# EAGLE board 612_jetracer_328_020022 (EAGLE 9.6.2)
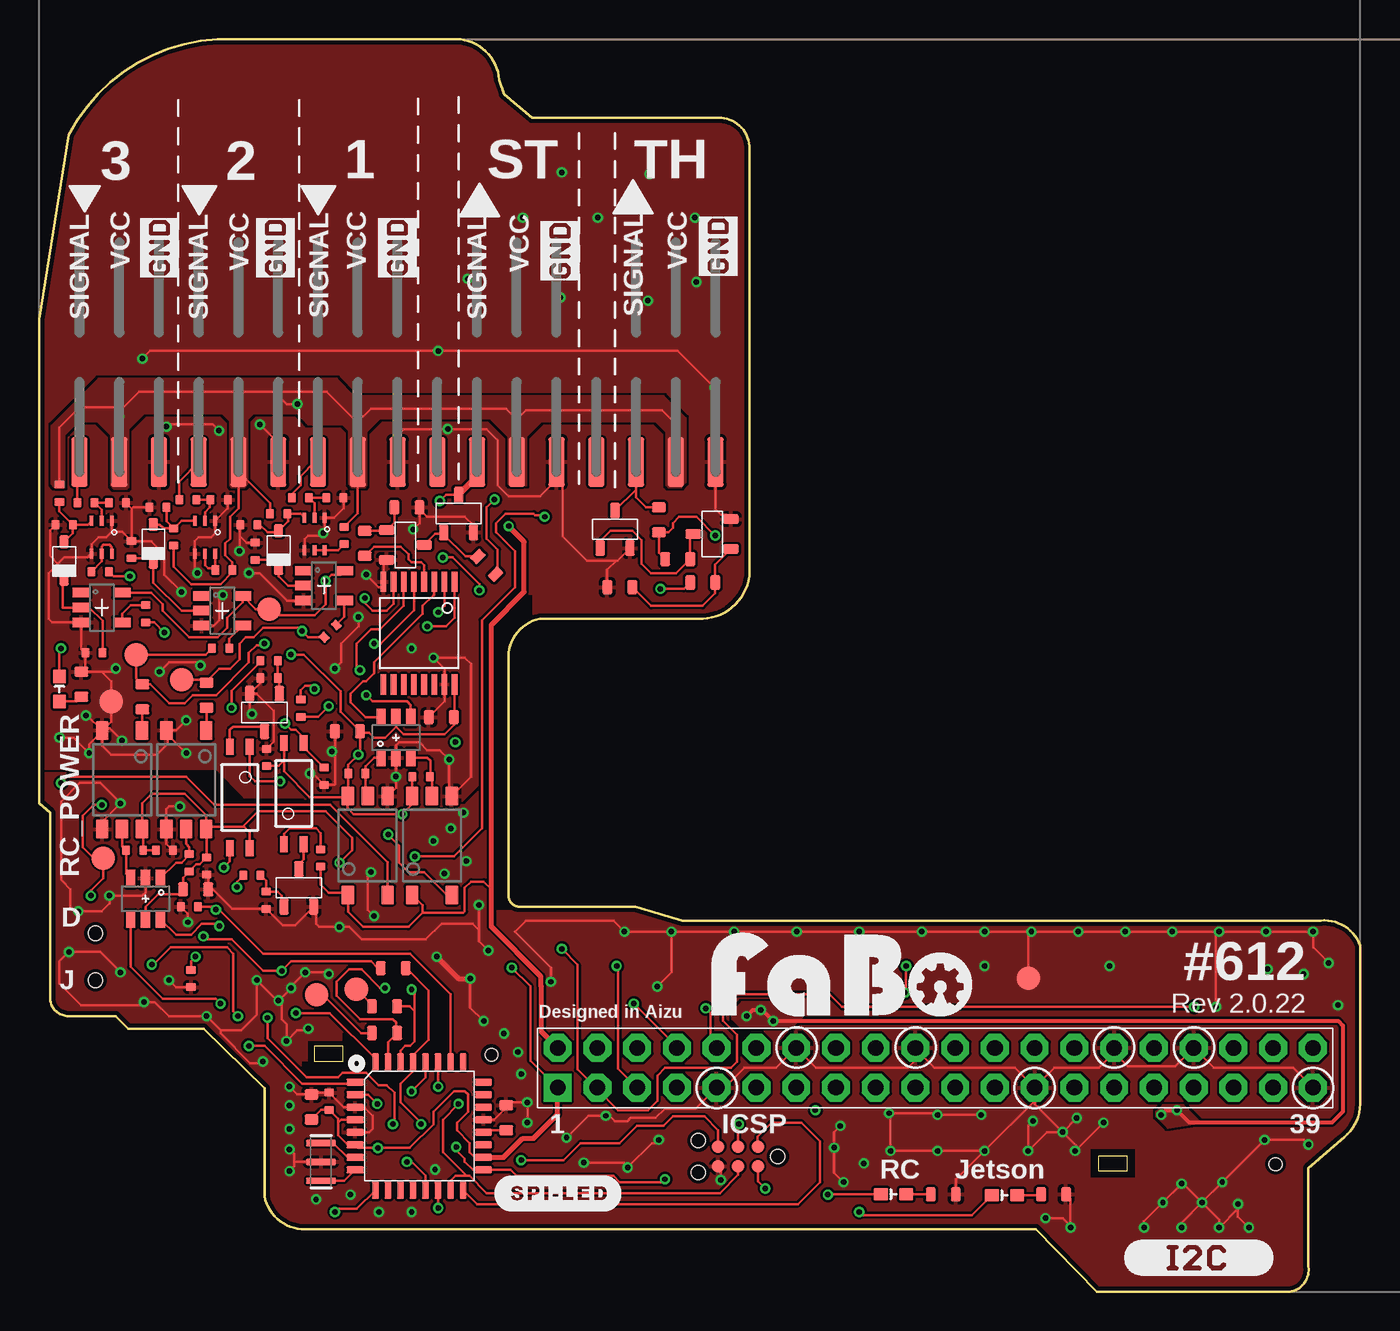
[diagram p9: board, top side]
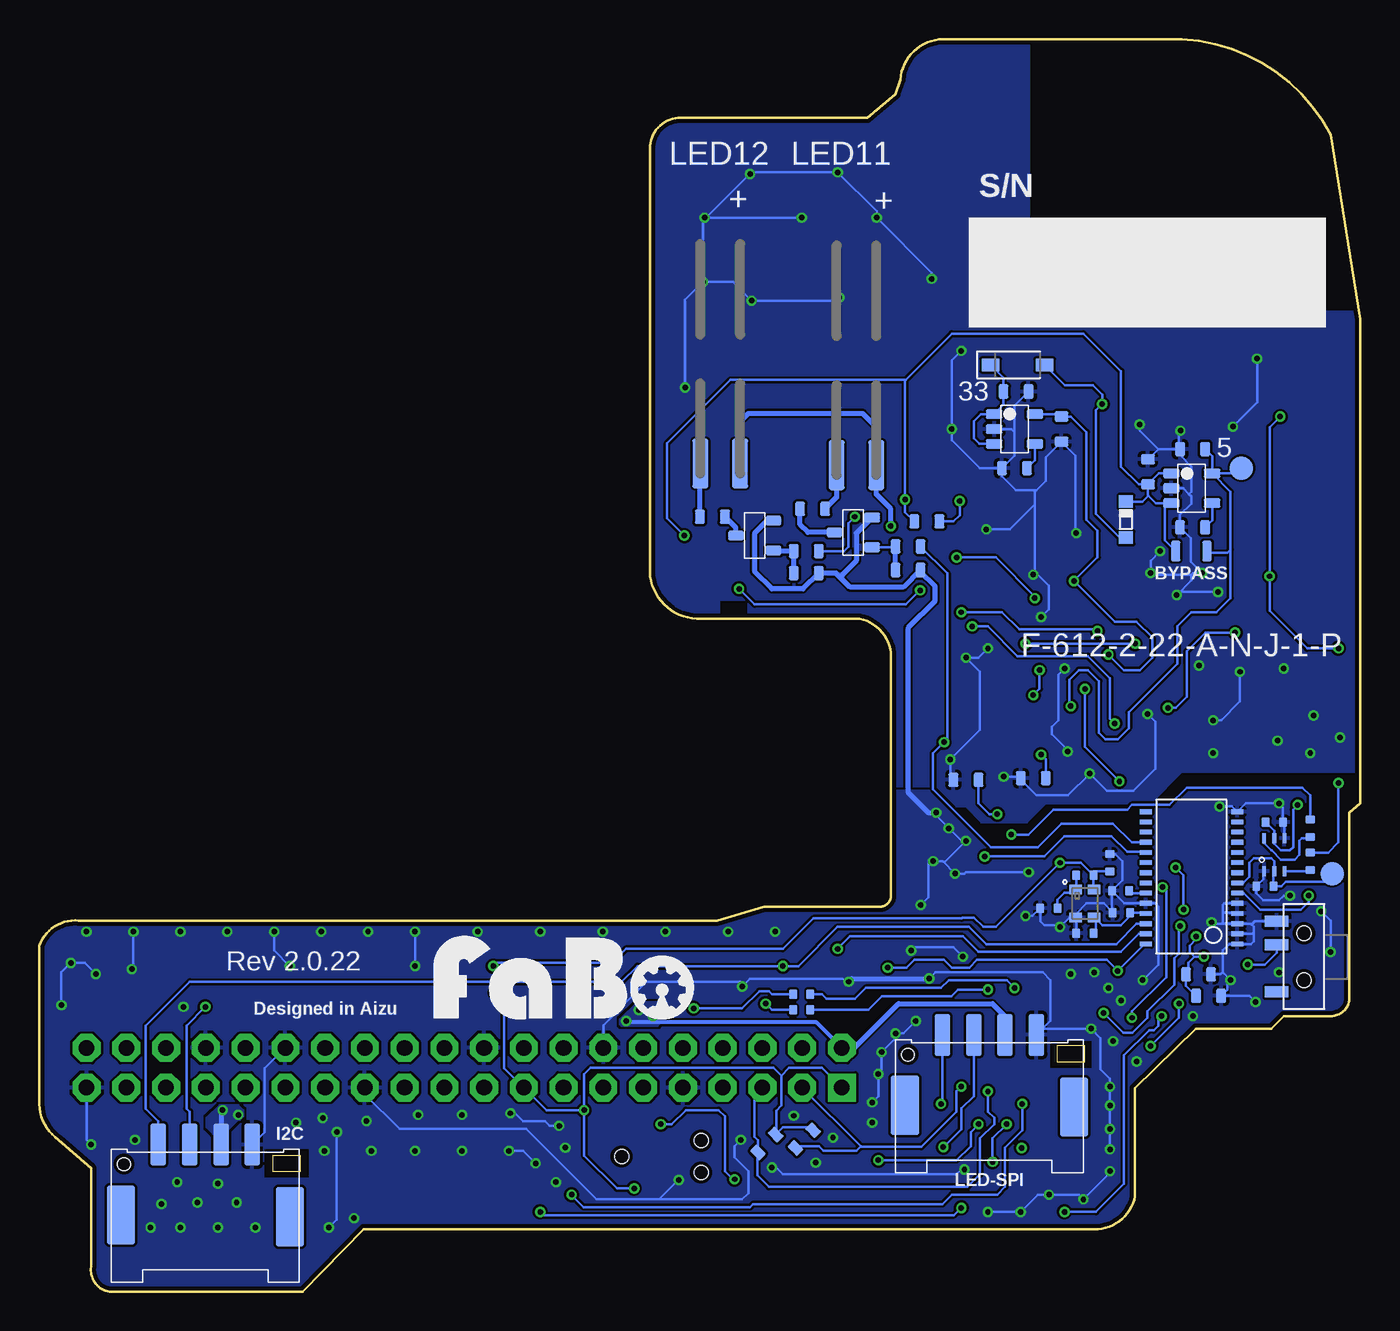
[diagram p10: board, bottom side, seen from below]

Size 84.42 x 80.01 mm. Coordinates in mm from the lower left corner, seen from the top.
Outline: 0,31.2 0,62.1 1.9,73.9 arc-60 11.4,80 26.4,80 arc-90 29.4,77.4 29.7,76.5 31.5,75 43.4,75 arc-90 45.4,73 45.4,46 arc-86 42.4,43 32,43 arc71 30,40.8 30,25.3 arc85 30.6,24.6 38.1,24.6 41.1,23.7 81.9,23.7 arc-78 84.4,22.1 84.4,12.5 arc-61 83.2,9.7 81.1,7.9 81.1,1.6 arc-90 79.9,0 67.6,0 63.7,4 17,4 arc-80 14.4,6.1 14.4,13 10.5,16.8 5.7,16.8 4.9,17.6 1.9,17.6 arc-85 0.7,18.7 0.7,30.6 0,31.2
Copper layers (1*16): Top 0.035mm / dielectric 1.6mm / Bottom 0.035mm
Design rules "PCBway": minimum track width 6mil, minimum drill 12mil, track to track 6mil, track to pad 6mil, pad to pad 6mil, via to via 6mil, smd to smd 6mil, copper to edge 10mil, drill to drill 10mil, minimum pad ring 10mil, minimum via ring 6mil, stop-mask expansion 2mil, vias tented up to drill 100mil, thermal gap 8mil
bKeepout: area 2.5,70.2 to 27,91.4
tRestrict: area 17.2,14.3 to 19.8,16; area 67.2,7.3 to 70,9.1; area 29.1,24.4 to 30.6,31.5; area 29.1,31.6 to 30.7,41.6; area 30.8,43 to 31.5,44.1; area 31.1,44.1 to 31.5,44.5; area 28.4,29.5 to 28.6,31.6; area 16.8,14.2 to 17.2,14.7; area 19.4,16 to 19.7,16.5
bRestrict: area -2.9,62.7 to 21.1,82.8; area 67.2,7.3 to 70,9.1; area 17.2,14.3 to 19.8,16; area 39.2,42.6 to 40.9,44.1

## Footprints (pad centres in the part's own frame; a part is rotated, then mirrored left to right if it is on the bottom)
0805 = smd 0.6 x 1.3: 1 -1,0; 2 1,0
0603 = smd 0.65 x 0.9: 1 -0.8,0; 2 0.8,0
0402 = smd 0.5 x 0.6: 1 -0.55,0; 2 0.55,0
SOD3715X135 = smd 1.127 x 0.784: 1 -1.722,0; 2 1.722,0
CUS05F40 = smd 0.8 x 0.9: A -1.15,0; C 1.15,0
SOD-323 = smd 0.8 x 0.6: A -1.2,0; K 1.2,0
PNHEADER_2.54_SMT_LEDLIGHT = smd 1.02 x 3.17: 1:GND -1.27,0; 2:POWER 1.27,0
I2C-BM04B-PASS-1 = smd 1 x 2.7: 5V -1,0; GND -3,0; SCL 3,0; SDA 1,0 | smd 1.8 x 3.8: P$5 -5.4,4.6; P$6 5.4,4.5 | hole 0.8: 5.2,1.25
TQFP-32 = smd 1.1 x 0.45: 1 -4.1,2.8; 2 -4.1,2; 3 -4.1,1.2; 4 -4.1,0.4; 5 -4.1,-0.4; 6 -4.1,-1.2; 7 -4.1,-2; 8 -4.1,-2.8; 17 4.1,-2.8; 18 4.1,-2; 19 4.1,-1.2; 20 4.1,-0.4; 21 4.1,0.4; 22 4.1,1.2; 23 4.1,2; 24 4.1,2.8 | smd 0.45 x 1.1: 9 -2.8,-4.1; 10 -2,-4.1; 11 -1.2,-4.1; 12 -0.4,-4.1; 13 0.4,-4.1; 14 1.2,-4.1; 15 2,-4.1; 16 2.8,-4.1; 25 2.8,4.1; 26 2,4.1; 27 1.2,4.1; 28 0.4,4.1; 29 -0.4,4.1; 30 -1.2,4.1; 31 -2,4.1; 32 -2.8,4.1
JETSON_NANO_NOBOARDER = drill 1 pad 1.778 square: 1 1.27,1.27 | drill 1 pad 1.778 octagon: 2 1.27,3.81; 3 3.81,1.27; 4 3.81,3.81; 5 6.35,1.27; 6 6.35,3.81; 7 8.89,1.27; 8 8.89,3.81; 9 11.43,1.27; 10 11.43,3.81; 11 13.97,1.27; 12 13.97,3.81; 13 16.51,1.27; 14 16.51,3.81; 15 19.05,1.27; 16 19.05,3.81; 17 21.59,1.27; 18 21.59,3.81; 19 24.13,1.27; 20 24.13,3.81; 21 26.67,1.27; 22 26.67,3.81; 23 29.21,1.27; 24 29.21,3.81; 25 31.75,1.27; 26 31.75,3.81; 27 34.29,1.27; 28 34.29,3.81; 29 36.83,1.27; 30 36.83,3.81; 31 39.37,1.27; 32 39.37,3.81; 33 41.91,1.27; 34 41.91,3.81; 35 44.45,1.27; 36 44.45,3.81; 37 46.99,1.27; 38 46.99,3.81; 39 49.53,1.27; 40 49.53,3.81
TSSOP-16 = smd 0.36 x 1.3: 1 -2.275,-3.28; 2 -1.625,-3.28; 3 -0.975,-3.28; 4 -0.325,-3.28; 5 0.325,-3.28; 6 0.975,-3.28; 7 1.625,-3.28; 8 2.275,-3.28; 9 2.275,3.28; 10 1.625,3.28; 11 0.975,3.28; 12 0.325,3.28; 13 -0.325,3.28; 14 -0.975,3.28; 15 -1.625,3.28; 16 -2.275,3.28
PCA9685_BOTTOM = smd 0.3 x 0.75 bottom: 1 4.3,-2.93; 2 3.65,-2.93; 3 3,-2.93; 4 2.35,-2.93; 5 1.7,-2.93; 6 1.05,-2.93; 7 0.4,-2.93; 8 -0.25,-2.93; 9 -0.9,-2.93; 10 -1.55,-2.93; 11 -2.2,-2.93; 12 -2.85,-2.93; 13 -3.5,-2.93; 14 -4.15,-2.93; 15 -4.15,2.92; 16 -3.5,2.92; 17 -2.85,2.92; 18 -2.2,2.92; 19 -1.55,2.92; 20 -0.9,2.92; 21 -0.25,2.92; 22 0.4,2.92; 23 1.05,2.92; 24 1.7,2.92; 25 2.35,2.92; 26 3,2.92; 27 3.65,2.92; 28 4.3,2.92
SOT-23-5 = smd 0.6 x 1.05: 1 -0.95,-1.3; 2 0,-1.3; 3 0.95,-1.3; 4 0.95,1.3; 5 -0.95,1.3
TC2030 = smd 0.787 x 0.787: 1 1.27,-0.635; 2 1.27,0.635; 3 2.54,-0.635; 4 2.54,0.635; 5 3.81,-0.635; 6 3.81,0.635 | hole 0.889: 0,0; 5.08,-1.016; 5.08,1.016
0603' = smd 0.9 x 0.8: ANODE -0.8,0; CATHODE 0.8,0
SPI-BM04B-PASS-1 = smd 1 x 2.7: 5V -1,-0.1; CI 1,-0.1; DI 3,-0.1; GND -3,-0.1 | smd 1.8 x 3.8: P$5 -5.4,4.5; P$6 5.4,4.4 | hole 0.8: 5.2,1.15
SOT-23 = smd 0.6 x 1: 1 -0.95,-1.2; 2 0.95,-1.2; 3 0,1.2
SSSS810701 = smd 0.7 x 1.5: 1 -2.25,1.75; 2 0.75,1.75; 3 2.25,1.75 | hole 0.9: -1.5,0; 1.5,0
SOT-23-6 = smd 0.6 x 1.1: 1 -0.95,-1.3; 2 0,-1.3; 3 0.95,-1.3; 4 0.95,1.3; 5 0,1.3; 6 -0.95,1.3
TP-15 = smd 1.5 x 1.5: 1 0,0
11-3C1 = smd 1 x 0.5: 1 -3.24,0.635; 2 -3.24,-0.635; 3 3.24,-0.635; 4 3.24,0.635
US6 = smd 0.3 x 0.635: 1 -0.65,-1.05; 2 0,-1.05; 3 0.65,-1.05; 4 0.65,1.05; 5 0,1.05; 6 -0.65,1.05
SOT-23' = smd 1.1 x 0.6: 1 -1.3,0.95; 2 -1.3,0; 3 -1.3,-0.95; 4 1.3,-0.95; 5 1.3,0.95
PNHEADER_2.54_SMT_17PIN_RC_TT01_02 = smd 1.02 x 3.17: 1:SIGNAL3 -20.32,0; 2:VCC3 -17.78,0; 3:GND3 -15.24,0; 4:SIGNAL2 -12.7,0; 5:VCC2 -10.16,0; 6:GND2 -7.62,0; 7:SIGNAL1 -5.08,0; 8:VCC1 -2.54,0; 9:GND1 0,0; 10:NC1 2.54,0; 11:ST_SIGNAL 5.08,0; 12:ST_VCC 7.62,0; 13:ST_GND 10.16,0; 14:NC2 12.7,0; 15:TH_SINGNAL 15.24,0; 16:TH_VCC 17.78,0; 17:TH_GND 20.32,0
TLP2362 = smd 0.8 x 1.2: 1 -1.27,-3.15; 3 1.27,-3.15; 4 1.27,3.15; 5 0,3.15; 6 -1.27,3.15
KC2016Z = smd 0.6 x 0.8: #1 -0.9,-0.6; #2 0.9,-0.6; #3 0.9,0.6; #4 -0.9,0.6
CSTNE_V_C = smd 0.4 x 1.9: 1 1.2,0; 2 0,0; 3 -1.2,0

## Placement (x,y rotation side)
BYPASS  DNP/0806  [0805]  10.8,47.3 180 bottom
C1  0.1uF  [0603]  29.84,11.12 270 top
C2  0.1uF  [0603]  10.35,20.27 180 bottom
C3  0.1uF  [0402]  18.52,12.17 270 top
C4  0.1uF/0402  [0402]  10.7,27.2 90 top
C5  0.1uF/0402  [0402]  9.7,20 90 top
C6  10uF  [0603]  9.7,18.9 180 bottom
C7  10uF/0402  [0402]  16,27.4 90 bottom
C8  20pF/0402  [0402]  17.6,22.9 180 bottom
C9  0.1uF  [0603]  20.9,32.8 0 bottom
C10  0.1uF  [0603]  25.7,36.7 0 top
C11  4.7uF  [0603]  19.1,55.1 90 bottom
C12  0.1uF  [0603]  10,25.7 0 top
C13  0.01uF  [0603]  22.1,52.6 0 bottom
C14  0.01uF  [0603]  10.72,48.82 0 bottom
C15  4.7uF  [0603]  10.72,53.83 0 bottom
C16  1uF  [0603]  22,57.5 180 bottom
C18  0.1uF/0402  [0402]  8,28.2 180 top
C19  0.1uF/0402  [0402]  14.53,34.12 270 top
C20  0.1uF  [0603]  25.2,32.7 0 bottom
C21  1uF  [0603]  13.57,52.37 270 bottom
C22  0.1uF  [0603]  19.7,35.8 0 top
C23  10uF  [0603]  17.4,11.8 90 top
D1  1N4148W  [SOD3715X135]  21.9,59.2 0 bottom
D2  CUS05F40  [CUS05F40]  14.97,49.32 90 bottom
D4  [SOD-323]  15.3,47.4 270 top
D6  [SOD-323]  7.3,47.8 270 top
D7  [SOD-323]  1.6,46.7 270 top
FRONT_LED  RC_LIGHT  [PNHEADER_2.54_SMT_LEDLIGHT]  40.9,52.9 0 bottom
I2C  FABO-I2C_BM04B  [I2C-BM04B-PASS-1]  73.8,9.4 180 bottom
IC1  [TQFP-32]  24.29,10.59 0 top
IC2  JETSON_NANO_NOBORDER  [JETSON_NANO_NOBOARDER]  31.86,11.77 0 top
IC3  MULTIPLEXERSMC74HC157A  [TSSOP-16]  24.27,42.07 180 top
IC4  PCA9685_BOTTOM  [PCA9685_BOTTOM]  10.79,26.51 270 top
IC5  [SOT-23-5]  10.78,51.32 270 bottom
IC7  [SOT-23-5]  22.1,55.1 270 bottom
ICSP1  [TC2030]  47.2,8.63 180 top
JETSON  GREEN  [0603']  54.59,6.24 0 top
LED-SPI  [SPI-BM04B-PASS-1]  23.7,16.3 180 bottom
M1  MOSFET-N_FDV301N  [SOT-23]  38.7,48.3 90 bottom
M4  MOSFET-N_FDV301N  [SOT-23]  32.4,48.5 90 bottom
R1  0/0402  [0402]  15.28,24.22 0 bottom
R2  10K  [0603]  22.62,20.67 180 top
R3  10K/0402  [0402]  15.32,25.62 0 bottom
R4  330/0402  [0402]  3.2,29.6 270 bottom
R5  470  [0603]  64.82,6.22 180 top
R6  330/0402  [0402]  3.2,27.5 270 bottom
R7  0/0402  [0402]  18.6,42.2 45 top
R8  0/0402  [0402]  11.6,41.1 0 top
R9  0/0402  [0402]  6.8,43.3 90 top
R10  1K  [0603]  57.77,6.22 180 top
R11  1K  [0603]  28.6,46.4 135 top
R12  470  [0603]  22.07,18.23 0 top
R13  470  [0603]  22.07,16.52 0 top
R14  330  [0603]  27.7,49.2 0 bottom
R15  220  [0603]  6.6,38 270 top
R17  DNP/0402  [0402]  6.1,25.9 0 bottom
R18  100  [0603]  20.8,47.8 90 top
R19  1K  [0603]  23.5,50.1 0 top
R20  1K  [0603]  40.8,46.8 0 top
R21  330  [0603]  39.6,49.3 90 top
R22  10K  [0603]  37.92,9.47 45 bottom
R23  10K  [0603]  35.53,9.75 45 bottom
R24  4.7K/0402  [0402]  9.6,24.6 180 top
R25  220/0402  [0402]  16.73,37.27 90 top
R26  DNP/0402  [0402]  5.5,30 180 bottom
R27  220  [0603]  10.7,38.1 270 top
R28  4.7K/0402  [0402]  14.7,40.3 180 top
R29  10K/0402  [0402]  18.23,32.92 90 top
R30  220/0402  [0402]  18,27.7 270 top
R32  10K/0402  [0402]  14.7,39.2 180 top
R33  470  [0603]  2.7,38.8 90 top
R35  1K/0402  [0402]  13.6,26.6 180 top
R36  10K/0402  [0402]  14.5,25 90 top
R37  1K  [0603]  35.4,47.3 0 bottom
R38  10K  [0603]  28.9,47.6 0 bottom
R39  75  [0603]  41.4,49.5 180 bottom
R40  75  [0603]  35,50 0 bottom
R41  DNF  [0603]  35.4,45.9 180 bottom
R42  DNF  [0603]  28.9,46.1 180 bottom
R43  0/0402  [0402]  17.6,26.6 0 bottom
R44  DNP/0402  [0402]  19.9,24.5 0 bottom
R45  DNP/0402  [0402]  35.7,18 180 bottom
R46  DNP/0402  [0402]  35.7,19 180 bottom
R47  100  [0603]  42.4,45.3 0 top
R48  1K  [0603]  37.1,45 180 top
R49  390/0402  [0402]  9.6,27.4 270 top
R50  390/0402  [0402]  6.1,28.2 0 top
R51  390/0402  [0402]  20.3,33.1 180 top
R52  390/0402  [0402]  24.4,32.9 180 top
R55  1K/0402  [0402]  19.5,48.3 90 top
R56  1K/0402  [0402]  15.3,49.7 180 top
R57  1K/0402  [0402]  11.8,46.1 0 top
R58  1K/0402  [0402]  8.6,48.2 270 top
R59  1K/0402  [0402]  3.9,46 0 top
R60  1K/0402  [0402]  1.3,51 90 top
R61  100/0402  [0402]  16.7,50.7 0 top
R62  100/0402  [0402]  9.5,50.6 0 top
R63  100/0402  [0402]  3,50.4 0 top
R64  4.7K/0402  [0402]  13.8,47.3 270 top
R65  4.7K/0402  [0402]  5.9,47.4 270 top
R66  4.7K/0402  [0402]  3.5,40.8 0 top
R67  100K/0402  [0402]  5,50.4 180 top
R68  100K/0402  [0402]  11.5,50.6 180 top
R69  100K/0402  [0402]  18.9,50.7 180 top
R70  4.7K/0402  [0402]  13.4,49 0 top
R71  4.7K/0402  [0402]  7.6,50.1 0 top
R72  4.7K/0402  [0402]  1.6,49 0 top
RC  RED  [0603']  61.68,6.17 0 top
RC_POWER  ORANGE  [0603']  1.3,38.5 270 top
REAR_LED  RC_LIGHT  [PNHEADER_2.54_SMT_LEDLIGHT]  32.2,52.8 0 bottom
S1  [SSSS810701]  3.6,21.4 90 bottom
T1  [SOT-23]  14.4,37 180 top
T2  [SOT-23]  16.6,25.8 0 top
T3  T2N7002AK  [SOT-23]  26.8,49.7 0 top
T4  T2N7002AK  [SOT-23]  36.8,48.7 0 top
T5  SN74LVC2G04  [SOT-23-6]  6.8,25.1 180 top
T6  SN74LVC2G04  [SOT-23-6]  22.8,35.4 0 top
T10  T2N7002AK  [SOT-23]  23.4,47.7 270 top
T11  T2N7002AK  [SOT-23]  43,48.4 90 top
TP1  [TP-15]  20.27,19.32 90 top
TP2  [TP-15]  17.73,18.98 0 top
TP3  [TP-15]  63.21,20.02 0 top
TP4  [TP-15]  14.7,43.6 0 top
TP5  [TP-15]  9.1,39.1 0 top
TP6  [TP-15]  6.2,40.7 0 top
TP7  [TP-15]  4.6,37.7 0 top
TP8  [TP-15]  4.1,27.7 0 top
TP9  [TP-15]  1.8,26.7 0 bottom
TP10  [TP-15]  7.6,52.6 0 bottom
U3  TLP291A  [11-3C1]  12.82,31.57 270 top
U7  TLP291A  [11-3C1]  16.27,31.82 90 top
U12  SSM6N7002KFU  [US6]  10.6,48.2 180 top
U20  SN74LVC1G17  [SOT-23']  11.7,43.5 0 top
U21  SSM6N7002KFU  [US6]  4,48.2 180 top
U23  SN74LVC1G17  [SOT-23']  4,43.7 0 top
U$1  RC_17PIN_OUTIN  [PNHEADER_2.54_SMT_17PIN_RC_TT01_02]  22.9,53 0 top
U$2  [LOGO_FABO_L]  50.6,17.6 0 top
U$3  [LOGO_FABO_L]  51.6,17.4 0 bottom
U$5  [LOGO_SILK_GND]  16.35,64.77 90 top
U$6  SSM6N7002KFU  [US6]  5.5,27.9 0 bottom
U$7  SN74LVC1G17  [SOT-23']  18.2,45.1 0 top
U$8  TLP2362  [TLP2362]  21,28.5 0 top
U$9  [LOGO_SILK_GND]  24.15,64.77 90 top
U$10  SSM6N7002KFU  [US6]  17.6,48.4 180 top
U$11  KC2016Z  [KC2016Z]  17.6,24.8 270 bottom
U$12  [LOGO_SILK_GND]  34.55,64.57 90 top
U$13  [LOGO_SILK_GND]  44.65,64.87 90 top
U$14  [LOGO_SILK_I2C]  74.1,1 0 top
U$15  TLP2362  [TLP2362]  25.1,28.5 0 top
U$16  TLP2362  [TLP2362]  9.4,32.7 180 top
U$17  TLP2362  [TLP2362]  5.3,32.7 180 top
U$19  [LOGO_SILK_GND]  8.95,64.77 90 top
X2  16MHz  [CSTNE_V_C]  18.01,8.29 90 top

## Tracks (layer width: path | path; a pad name or v marks a point on that pad's centre or on a via)
0  (via drill 0.35)
  Top 0.152: v11.5,55 11.1,55.4 8.3,55.4 v8.15,55.25 7.66,54.76 U$1.3:GND3 | U$1.6:GND2 15.28,54.22 v14.1,55.4 | v6.6,59.6 7.1,60.1 v25.5,60.1 40.8,60.1 v43.15,57.75 43.22,57.68 U$1.17:TH_GND 43.22,49.99 43.57,49.64 43.91,49.64 T11.2 | 33.06,51.86 U$1.13:ST_GND | T1.2 14.15,38.9 R32.2 | C19.1 15,35.15 15,37.1 13.9,38.2 T1.2 | v13.6,36.9 13.45,37.05 T1.2 | 33.06,51.86 32,50.8 30,50.8 29.3,51.5 29.3,54.4 28.6,55.1 v26.1,55.1 23.3,55.1 22.9,54.7 U$1.9:GND1 | 33.06,51.86 33.46,52.26 33.46,48.24 35,46.7 36.9,46.7 | v17.3,33.1 17.5,33.1 R29.1 18.87,32.37 18.9,32.4 18.9,34.3 v18.7,34.5 18.9,34.7 C22.1 | U20.3 11.15,42.55 11.5,42.9 11.5,44.27 v11.73,44.5 | v13.4,45.9 14.1,45.9 15.85,44.15 U$7.3 | v9.1,44.7 8,45.8 8,47.1 7.15,47.95 R65.1 | 1.2,46.5 0.6,45.9 0.6,43 0.85,42.75 U23.3 2.7,41.05 R66.1 2.95,39.85 R33.2 4,39.6 | 1.2,46.5 1.6,46.9 3.1,46.9 U21.4 3.35,47.75 3.8,48.2 4.3,48.2 4.65,48.55 | 1.2,46.5 0.7,47 0.7,48.65 R72.1 | R64.1 13.25,47.85 12.8,48.3 | U$10.4 16.95,48.05 17.2,48.3 18,48.3 v18.15,48.45 18.25,48.55 U$10.1 18.85,49.45 19.45,50.05 R69.1 | R65.1 5.9,50 | R71.1 6,50.1 5.9,50 | 4.65,48.55 U21.1 | R65.1 5.3,48.55 4.65,48.55 | 12.8,48.3 12.8,48.95 R70.1 | 12.8,48.3 v12.8,47.3 | R67.1 5.55,50.35 5.9,50 | v23.9,48.7 24.3,49.1 24.3,50 | 24.3,50 R19.2 | T3.2 27.75,48.95 27.2,49.5 24.8,49.5 24.3,50 | v20.9,45.8 21.7,45 22,45 IC3.8 22,46.55 T10.2 | v20.4,43.1 20.4,42.5 19.3,41.4 19.3,40.2 v18.9,39.8 | R48.2 36.3,46.1 36.9,46.7 | U$8.4 22.8,32.18 v22.8,32.9 T6.2 22.8,34.9 23,35.1 24.3,35.1 24.8,34.6 25.6,34.6 v26.2,34 26.2,31.82 U$15.4 27.6,32.88 27.6,40.1 27.2,40.5 v25.2,40.5 25.9,39.8 IC3.15 25.9,37.7 C10.1
  Top 0.152: U$17.3 4.03,36 4.5,36 v5.3,35.2 | U$17.3 4.03,35.8 | 4.03,35.8 4.03,34.87 4.6,34.3 7.5,34.3 8.2,35 8.2,35.78 U$16.3 | U$17.3 3.08,36.8 v3,36.8 | T4.2 36.95,46.7 36.9,46.7 | R68.1 12.05,50.05 U12.1 11.25,48.45 11,48.2 10.2,48.2 9.95,47.95 U12.4 9.95,46.05 v10.1,45.9 | v1.3,35.4 2.2,35.4 v3.2,34.4 3.2,34.97 4.03,35.8 | v7.7,39.6 8.3,40.2 10.1,40.2 v10.3,40 | U$16.3 8.75,35.85 v9.4,36.5 | v9.4,34.4 8.13,35.67 U$16.3 | U$17.3 4.6,36.42 TP7.1 4.6,39 4,39.6 | 4,39.6 4.7,39.6 v4.9,39.8
  Bottom 0.152: C21.1 12.92,53.83 | 12.92,53.83 11.6,53.83 | 11.6,53.83 C15.1 11.52,53.42 10.8,52.7 10.8,51.1 10.95,50.95 | 10.95,50.95 10.8,50.8 10.8,50.34 11.53,49.62 C14.1 10.82,48.12 10.82,46.62 v10.1,45.9 10.7,45.9 10.8,45.8 | 10.95,50.95 11.32,51.32 IC5.2 | v11.5,55 11.6,54.9 11.6,53.83 | v14.1,55.4 14.1,55.01 12.92,53.83 | v27.4,64.7 27.4,65.1 v30.9,68.6 30.9,69 v33.4,71.5 38.9,71.5 v39,71.4 41.8,68.6 v41.9,68.6 | v41.9,68.6 v35.7,68.6 | v41.9,68.6 42,68.5 v42,64.5 | v33.3,63.5 33.5,63.3 v38.9,63.3 40.1,64.5 v42,64.5 | v42,64.5 43.15,63.35 v43.15,57.75 | v6.6,59.6 6.6,56.8 v8.15,55.25 | v13.6,36.9 13.1,36.4 13.1,33.4 14.49,32.01 16.2,32.01 v17.3,33.1 18.7,31.7 20.7,31.7 21.7,32.7 C9.1 21.8,32.9 v22.8,32.9 | v25.5,60.1 26.1,59.5 v26.1,55.1 26.1,54.4 24.3,52.6 C13.1 | v23.8,41.1 24.4,40.5 v25.2,40.5 24.3,39.6 24.3,35.9 v26.2,34 26.2,32.9 C20.1 | 22.1,54.9 22.1,53.4 C13.1 | 22.1,54.9 22.1,56.6 C16.1 | 20.7,51.2 20.1,51.8 20.1,53.3 C11.1 18.2,53.4 18.2,48.5 v18.15,48.45 | 20.7,51.2 22,51.2 22.9,52.1 C13.1 | 10.8,45.8 13.3,45.8 v13.4,45.9 13.4,46.7 v12.8,47.3 | 10.8,45.8 10.8,45.43 v11.73,44.5 11.53,44.7 v9.1,44.7 | IC7.2 22.3,55.1 22.1,54.9 | 20.7,51.2 20.8,51.1 20.8,50.3 | 20.8,50.3 22.4,48.7 v23.9,48.7 | 20.8,50.3 20.8,45.9 | 20.8,45.9 v20.9,45.8 | v20.4,43.1 19.9,43.6 19.9,45.1 20.7,45.9 20.8,45.9 | v18.9,39.8 19.3,39.4 19.3,36.5 19.7,36.1 19.7,35.6 18.7,34.6 v18.7,34.5 | v9.4,36.5 8.9,36.5 7.7,37.7 v7.7,39.6
  pour Bottom (rank 2): 36.6,32.3 27.1,32.3 25.8,31 25.2,31 24.2,30 21.3,30 20.1,31.2 13.4,31.2 11.4,33.2 0.2,33.2 -1.7,35.1 -1.7,87.1 4.8,93.6 47.4,93.6 48.8,92.2 48.8,44.5
  pour Top (rank 2): 36.6,33.3 29,33.3 26.7,31 25.2,31 24.2,30 20.5,30 19,31.5 17,31.5 16.9,31.6 13.1,31.6 11.3,33.4 0.3,33.4 -1.4,35.1 -1.4,86.4 5.2,93 47.3,93 48.5,91.8 48.5,45.2
3V3  (via drill 0.35)
  Top 0.152: v46.4,6.6 45.93,7.07 ICSP1.2 | IC2.1 31.4,14.77 31.4,19.5 v30.2,20.7 | IC1.18 27.82,8.59 27.5,8.9 27.5,9.5 26.7,10.3 26.7,10.8 27.4,11.5 27.4,12.6 27.2,12.8 26.5,12.8 25.2,11.5 25.2,10.7 23.68,9.19 v21.64,9.19 20.39,9.19 IC1.6 19.72,9.38 19.1,10.01 19.1,10.8 | 19.1,10.8 19.1,11.04 C3.2 18.02,11.62 C23.1 | IC1.4 19.29,10.98 19.1,10.8 | v55.3,19.1 55.4,19.2 v55.4,20.8 | R2.2 21.63,20.67 21.2,21.1 16.1,21.1 v15.5,20.5 14.3,20.5 12.3,22.5 10.7,22.5 v10.5,22.7 | v19.2,27.4 20,28.2 20,29 18.3,30.7 14,30.7 13,29.7 | U3.4 13.46,29.34 13.1,29.7 13,29.7 | 6.6,29.52 U$17.6 | U$16.6 10.82,29.7 13,29.7 | U$16.6 10.7,29.52 C4.2 10.25,27.3 10.05,27.3 R49.2 9.2,26.45 C12.1 8.9,25.4 7.6,25.4 6.8,24.6 T5.5 | C18.2 R50.2 6.65,29.47 6.6,29.52 | U$16.6 10.67,30.43 9.3,31.8 7.2,31.8 6.6,31.2 6.6,29.52 | C5.2 9.7,21.1 v10,21.4
  Top 0.305: IC1.18 29.68,8.59 30.9,9.8 31.6,9.8 33.13,11.33 IC2.1
  Bottom 0.152: 37,13.8 37,11.9 37.32,11.58 37.32,10.12 37.3,10.1 | 37,13.8 36.5,14.3 34.4,14.3 IC2.1 | 37,13.8 37.5,14.3 49.2,14.3 49.6,13.9 v49.6,11.6 | v49.6,11.6 49.6,8.7 47.5,6.6 v46.4,6.6 | IC4.28 13.79,22.21 v15.5,20.5 16.2,21.2 24.5,21.2 25,20.7 26.11,20.7 26.6,21.2 28.5,21.2 29,20.7 v30.2,20.7 | R43.2 17.05,25.75 U$11.#4 | C7.1 17.05,26.85 R43.2 | v55.4,20.8 55.2,21 47.83,21 46.93,21.91 36.9,21.91 34.96,23.84 25.47,23.84 25.41,23.9 24.7,23.9 24.1,23.3 23.3,23.3 v19.2,27.4 17.85,27.4 R43.2 | v55.3,19.1 54.7,18.5 54.7,14.29 IC2.17 52.02,11.6 v49.6,11.6 | v10.5,22.7 10.5,22.5 10.9,22.1 10.9,21.7 10.6,21.4 | R23.2 35.15,10.5 36.9,10.5 37.3,10.1 | 37.3,10.1 R22.2 | C6.2 11.14,19.55 C2.2 11,20.41 11,21 10.6,21.4 | 10.6,21.4 v10,21.4
5V  (via drill 0.35)
  Top 0.152: 24.5,24.2 23.6,23.3 20.7,23.3 19.73,24.27 U$8.1 19.58,25.5 18.5,25.5 18,26 R30.2 | 24.5,24.2 27.1,24.2 27.2,24.3 27.2,25.8 27.6,26.2 28.4,26.2 28.9,25.7 | U$15.1 24.5,24.68 24.5,24.2
  Top 0.254: v71.7,11.3 72,11.6 v72.7,11.6 73.5,10.8 82.6,10.8 83.3,11.5 83.3,17 83,17.3 v46.9,17.3 46.2,18 v46.1,18 45.6,18 v45.2,17.6
  Top 0.305: IC2.2 32.1,16.61 32.1,19.51 32.07,19.54 32.07,20.13 28.9,23.3 28.9,25.7 28.9,42.6 31,44.7 31,47.9 v30,48.9
  Bottom 0.152: 22.7,17.6 LED-SPI.5V | 30.93,53.1 REAR_LED.2:POWER 30.93,52.53
  Bottom 0.254: IC2.2 34.76,17.2 46.8,17.2 v46.9,17.3
  Bottom 0.305: IC2.2 32.33,15.57 29.5,18.4 23.5,18.4 22.7,17.6 | I2C.5V 72.8,11.5 v72.7,11.6 | v30,48.9 30,50 30.93,50.93 30.93,52.53 30.93,53.1 30.93,55.23 31.8,56.1 39.1,56.1 39.63,55.57 FRONT_LED.2:POWER
  pour Bottom (no thermals): 72.6,10.1 71.7,11 71.6,11 71.4,11.2 71.4,11.6 71.7,11.9 72.9,11.9 73.7,11.1 73.7,10.5 73.3,10.1
  pour Top (no thermals): 72.13,10.47 71.4,11.2 71.4,11.5 71.8,11.9 73.1,11.9 74.22,10.78
  pour Bottom (no thermals): 44.9,17 44.4,17.5 44.4,18 44.9,18.5 45.7,18.5 46.2,18.5 47.3,17.4 47.3,17.1 47.2,17
  pour Top: 44.3,17.4 44.3,17.9 44.9,18.5 47.2,18.5 47.3,18.4 48.1,18.4 48.7,17.8 48.7,17.5 48.1,16.9 44.8,16.9
AVR_MISO
  Top 0.152: IC1.16 27.98,5.6 48.5,5.6 49.9,7 49.9,9.6 48.7,10.8 46.8,10.8 45.9,9.9 45.9,9.3 ICSP1.1
AVR_MOSI  (via drill 0.35)
  Top 0.152: ICSP1.4 44.66,7.46 43.5,6.3 28.6,6.3 27.5,7.4 27.3,7.4 | 27.3,7.4 26.6,7.4 26.29,7.09 IC1.15 | v26.8,12 25.8,11 25.8,8.9 27.3,7.4
  Bottom 0.152: LED-SPI.DI 26.7,12.1 v26.8,12
AVR_RESET  (via drill 0.35)
  Top 0.152: ICSP1.5 43.39,10.31 42.5,11.2 40.5,11.2 39.9,10.6 38.2,10.6 37.1,9.5 34.6,9.5 33.5,8.4 v30.8,8.4 | v24.4,10.7 24.4,10.8 23.1,12.1 23.1,13.3 23.89,14.09 IC1.29 23.89,15.09 24.9,16.1 24.9,19.24 23.47,20.67 R2.1
  Bottom 0.152: v30.8,8.4 25.8,8.4 24.9,9.3 24.9,10.2 v24.4,10.7
AVR_RX  (via drill 0.35)
  Top 0.152: IC1.30 23.09,15.39 23.4,15.7 23.7,15.7 24,16 24,17.9 | R12.2 23.68,18.23 24,17.9 | 24,17.9 24,19.1 v23.8,19.3
  Bottom 0.152: v23.8,19.3 25.7,19.3 26.12,18.88 30.56,18.88 31.44,18 R45.1
AVR_SCK  (via drill 0.35)
  Top 0.152: ICSP1.3 44.66,10.66 v44.7,10.7 | v26.64,9.24 26.64,9.04 27.2,8.49 27.2,8.3 27.71,7.79 IC1.17 30.11,7.79 30.5,7.4 36.7,7.4 37.1,7 39.8,7 v39.98,7.18
  Bottom 0.152: v44.7,10.7 44,10.7 43.1,11.6 41,11.6 40.6,11.2 40.6,7.7 40.09,7.18 v39.98,7.18 | v26.64,9.24 25.5,10.39 25.5,11.37 25.5,11.71 24.7,12.5 LED-SPI.CI
AVR_TX  (via drill 0.35)
  Top 0.152: IC1.31 22.29,15.95 R13.2 22.8,16.59 22.8,17.2 22.6,17.4 20.5,17.4 19,18.9 19,19.8 19.8,20.6 20.6,20.6 21.8,19.4 v22.1,19.4
  Bottom 0.152: v22.1,19.4 22.59,19.89 26.3,19.89 26.8,19.41 31.59,19.41 32.3,18.7 34.1,18.7 34.4,19 R46.1
D3  (via drill 0.35)
  Top 0.152: RC.ANODE 59.62,4.9 52.6,4.9 v52.4,5.1 | IC1.14 v25.49,5.37 v25.5,5.36
  Bottom 0.152: v52.4,5.1 52.2,4.9 25.96,4.9 v25.5,5.36
D4  (via drill 0.35)
  Top 0.152: JETSON.ANODE 50.44,6.24 v50.4,6.2 | v21.6,12 21.02,12.59 IC1.2
  Bottom 0.152: v21.6,12 21.6,10.3 22.7,9.2 22.7,6.7 23.2,6.2 26.1,6.2 26.7,5.6 38.8,5.6 39,5.4 49.63,5.4 50.4,6.17 v50.4,6.2
GND  (via drill 0.35)
  Top 0.152: IC1.21 29.06,10.98 29.84,11.77 C1.1 30.02,12.1 v31.2,12.1 v31.2,10.8 | ICSP1.6 43.56,7.83 v43.56,7.14 | 16.3,8.29 X2.2 | IC1.5 21.09,10.19 21.3,10.4 21.3,11.23 20.8,11.74 20.24,11.74 IC1.3 19.46,11.79 C3.1 17.52,12.72 C23.2 16.5,12.6 v16,13.1 | v28.4,17.3 27.55,18.15 v27.55,20 | 55.99,15.5 55.99,14.79 55.5,14.3 49.65,14.3 IC2.14 47.09,14.3 45.05,14.3 43.79,13.04 IC2.9 41.95,11.7 40,11.7 39.4,11.1 37.8,11.1 37.6,10.9 36.8,10.9 36.46,11.24 v36.2,11.24 35.1,11.24 v33.7,9.84 | 55.99,15.5 IC2.20 | IC2.25 62.34,14.3 57.19,14.3 55.99,15.5 | IC2.25 64.88,14.3 67.7,14.3 68.69,15.29 | 68.69,15.29 IC2.30 | 68.69,15.29 69.58,14.4 72.59,14.4 IC2.34 75.05,14.3 80.12,14.3 IC2.39 | v32.7,19.8 32.7,20.7 30.4,23 31.1,23.7 36.7,23.7 v37.4,23 v40.4,23 | v60.4,9 v57.4,9 v54.4,9 54.4,11.3 v54.3,11.4 57.3,11.4 v57.4,11.3 v60.2,11.3 | v60.4,9 63.61,12.21 | 63.61,12.21 IC2.25 | v82.4,21 81.4,22 v81.4,23 v78.4,23 75.5,23 | 75.5,23 v75.4,23 v72.4,23 v69.4,23 v66.4,23 v63.4,23 | v63.4,23 v60.4,23 v56.4,23 v52.4,23 | v52.4,23 v48.4,23 v44.4,23 v40.4,23 | v40.4,23 40.4,20.4 v39.5,19.5 | v37.6,7.94 37.63,7.97 | 37.63,7.97 39.16,9.5 39.6,9.5 v39.6,9.7 | v16,7.7 16.3,8 16.3,8.29 | v16,9.1 16.3,8.8 16.3,8.29 | TP3.1 63.21,22.81 v63.4,23 | v66.2,9 66.25,9.05 | 66.25,9.05 v68,10.8 | v65.4,10.2 63.61,11.99 63.61,12.21 | v65.4,10.2 66.25,9.35 66.25,9.05 | v81.1,9.4 80.8,9.7 v78.3,9.7 v75.6,7 v74.3,5.7 | v34.8,8.24 37.36,8.24 37.63,7.97 | v52.7,18.9 52.7,22.7 v52.4,23 | v75.2,18.2 75.2,22.7 75.5,23 | R10.1 58.57,7.17 v60.4,9 | v74.3,5.7 75.4,4.6 v75.4,4.1 76.6,5.3 v76.6,5.6 76.6,4.8 v77.3,4.1 | v73,4.1 73,4.4 v74.3,5.7
  Top 0.152: v74.3,5.7 73.1,6.9 v73,6.9 v71.8,5.7 70.6,4.5 v70.6,4.1 | 11.6,16.7 12.9,16.7 13.9,17.7 v13.9,19.9 15.2,18.6 v15.3,18.6 | 11.6,16.7 v10.7,17.6 8.3,17.6 7.4,18.5 v6.7,18.5 6.5,18.3 2.7,18.3 1.3,19.7 1.3,21.1 v1.9,21.7 3.9,21.7 v5.2,20.4 | R24.2 9.5,24.15 v9.5,23.6 | 11.6,16.7 11.6,16.5 13.5,14.6 14.2,14.6 v14.3,14.7 | v17.2,16.8 17.1,16.7 16.5,16.7 v15.8,16 15.8,17.1 15.5,17.4 15.5,18.4 v15.3,18.6 | v15.3,18.6 v16.1,19.4 16.1,19.5 v17,20.4 18.4,20.4 v18.5,20.3 | v51.4,7 50.8,7.6 v50.8,9.2 50.8,10.2 v51.2,10.6 | v63.5,10.9 63.2,10.6 v63.2,9 64.4,10.2 v65.4,10.2 | v66.3,11.1 v65.4,10.2 | v64.3,4.7 65.4,4.7 65.9,4.2 v65.9,4.1 65.9,5.95 R5.1 | C18.1 8.13,28.62 U$16.4 8.13,30.83 8.3,31 v9,31 | C4.1 10.8,26.55 C12.2 11.1,25.7 12.35,24.45 R36.1 15.55,23.4 16.35,23.4 T2.2 17.7,24.45 17.7,23.5 17.9,23.3 v19.2,23.3 19.8,23.3 20.6,22.5 24.7,22.5 25.7,23.5 27.7,23.5 28.1,23.1 | U$17.4 4.03,30.03 v5.2,31.2 3.9,32.5 2.6,32.5 1.4,31.3 1.4,26.3 2,25.7 2,24.6 2.3,24.3 v2.5,24.3 4,24.3 4.5,24.8 v4.5,25.3 6.6,25.3 6.8,25.5 T5.2 | v28.1,24.7 28.1,23.1 | 28.1,23.1 28.1,22.4 v28.7,21.8 | v8.3,19.9 8.75,19.45 C5.1 | v21.4,24 21,24.4 21,26.6 v21.2,26.8
  Top 0.305: v25.4,21.4 26.8,20 v27.55,20
  Bottom 0.152: v43.56,7.14 44.8,5.9 | 44.8,5.9 48.8,5.9 53.3,10.4 61.4,10.4 63.61,12.61 IC2.25 | IC2.14 48.37,17.03 45.6,19.8 39.6,19.8 39.6,19.5 v39.5,19.5 39,20 33.1,20 32.8,19.7 | v27.55,20 27.15,20.4 20.3,20.4 19.8,19.9 19.8,17.3 LED-SPI.GND 20.3,16.8 v17.2,16.8 16.6,16.2 16.6,14.2 16,13.6 v16,13.1 v16,11.9 v16,10.4 v16,9.1 | IC4.4 7.91,24.2 8.8,24.2 | 8.71,23.51 IC4.3 7.01,23.51 6.95,23.45 | 8.71,23.51 8.8,23.6 8.8,24.2 | IC4.2 6.94,22.86 6.8,23 | 6.8,23 6.8,23.3 6.95,23.45 | 6.8,23 6.8,22.4 7,22.2 7.01,22.21 IC4.1 8.39,22.21 8.8,21.8 8.8,20.4 | v25.3,7.8 25.5,7.8 25.8,7.5 36.9,7.5 37.34,7.94 v37.6,7.94 | IC2.30 70,14.27 70,10.2 I2C.GND | 44.8,5.9 39.5,5.9 39.1,6.3 39.1,7.7 40,8.6 40,9.3 v39.6,9.7 | v51.2,10.6 51.8,10.6 52.1,10.9 53.5,10.9 54,11.4 v54.3,11.4 | v52.7,8.2 53.5,9 v54.4,9 | v16,7.7 16,7.6 v17.7,5.9 18,6.2 v19.9,6.2 20.6,6.2 v21.7,5.1 v23.8,5.1 | IC2.39 81.39,9.69 v81.1,9.4 | v65.4,10.2 65.4,4.6 v65.9,4.1 | v83,18.3 83,20.4 v82.4,21 81.5,21 v80.8,20.3 | R3.1 15.06,24.81 IC4.24 13.1,24.8 12.9,24.6 12.9,20.9 v13.9,19.9 | R3.1 15.88,24.27 R1.1 16.41,24.8 17.5,24.8 18.15,24.15 18.15,23.85 | U$6.1 6.2,26.8 6.2,26.35 R17.1 6.65,25.45 6.2,25 5.2,25 4.9,25.3 v4.5,25.3 | 18.15,23.85 C8.2 | 18.15,23.85 U$11.#2 18.6,23.9 v19.2,23.3 19.3,23.4 20.2,23.4 20.45,23.65 R44.1 20.95,24 v21.4,24 | R3.1 15.2,26.3 15.2,27.5 15.65,27.95 C7.2 | U$6.4 4.85,29.9 R26.1 4.95,30.95 v5.2,31.2 7.33,31.2 IC4.14 8.21,31 v9,31 | v9.5,23.6 9.41,23.51 8.71,23.51 | 26.65,27.45 v25.9,26.7 25.3,26.7 25.2,26.8 v21.2,26.8 | 26.65,27.45 26.7,27.5 v27.3,27.5 27.6,27.5 27.6,25.2 v28.1,24.7 | 26.65,27.45 26.55,27.45 v25.2,28.8 25.5,28.8 v26.3,29.6 27.1,30.4 v27.1,30.6
  Bottom 0.152: v31.2,12.1 30.8,12.5 v30.8,13.9 30.6,14.1 v30.6,15.3 29.7,16.2 v29.7,16.5 29.2,16.5 v28.4,17.3 | v78.5,20.6 78.4,20.7 v78.4,23 | v68.4,20.8 69.4,21.8 v69.4,23 | v60.4,20.8 v60.4,23 | IC4.5 8.69,24.81 8.8,24.7 8.8,24.2 | v6.7,18.5 7.1,18.9 C6.1 8.5,19.3 8.5,19.7 v8.3,19.9 8.8,20.4 | v25.4,21.4 26,22 28.5,22 v28.7,21.8 | S1.3 6.75,23.65 6.95,23.45 | 8.8,20.4 8.94,20.27 C2.1 | v2.5,24.3 1.9,23.7 v1.9,21.7
  Bottom 0.305: v27.55,20 32.5,20 v32.7,19.8 32.8,19.7 | M4.2 32.2,48.45 32.2,46.7 33.25,45.65 | 33.25,45.65 32.6,45 29.2,45 R42.1 28.1,46 27.2,45.1 27.2,44.1 28.9,42.4 28.9,31.9 27.6,30.6 v27.1,30.6 | 33.25,45.65 33.5,45.9 R41.1 35.6,44.9 37.6,44.9 38.7,46 38.7,48.45 37.9,49.25 M1.2
  pour Top (rank 3): -4.82,100.72 123.22,100.72 123.22,-10.88 -4.82,-10.88
  pour Bottom (rank 3): -7.58,100.17 125.07,100.17 125.07,-0.07 -7.58,-0.07
IN3  (via drill 0.35)
  Top 0.152: R28.2 14.15,40.25 12.3,38.4 v12.3,37.3 | R9.1 7.35,42.75 v8,42.1
  Bottom 0.152: v8,42.1 9.9,42.1 11.1,40.9 11.1,38 11.8,37.3 v12.3,37.3
LED0  (via drill 0.35)
  Top 0.152: v3.3,25.3 3.3,25.6 4.1,26.4 TP8.1 3.5,27.7 2.8,28.4 2.8,30.4 3.5,31.1 v4,31.1
  Bottom 0.152: R26.2 5.5,29.45 U$6.5 5.5,28.6 5.1,28.2 4.5,28.2 4.3,28.4 4.3,30.8 v4,31.1 | v3.3,25.3 3.3,24.9 3.8,24.4 6.4,24.4 7.46,25.46 IC4.6
LED0_3V3
  Top 0.152: U$8.5 20.85,31.8 R51.1 20.85,33.55 21.4,34.1 T6.1
LED0_5V
  Bottom 0.152: R6.2 3.3,26.85 U$6.3
LED0_NOT
  Top 0.152: T6.6 20.85,36.7 19.9,37.65 19.9,38.2 20.7,39 20.9,39 21.39,39.49 21.39,40.19 24.5,43.3 24.5,43.8 25.2,44.5 25.25,44.5 IC3.3
LED1
  Bottom 0.152: IC4.7 7.49,26.11 7.1,26.5 7.1,27.4 6.8,27.7 5.7,27.7 5.5,27.5 U$6.2 5.55,26.8 R17.2 5.05,25.9 4.75,26.2 2.3,26.2 TP9.1
LED1_3V3
  Top 0.152: U$15.5 25.1,32.75 R52.1 25,32.95 25,33.9 24.8,34.1 T6.3
LED1_5V
  Bottom 0.152: U$6.6 6.15,28.66 5.7,28.2 5.67,28.2 5.07,27.6 4.2,27.6 3.9,27.9 3.9,28.8 3.75,28.95 3.3,28.95 R4.2
LED1_NOT  (via drill 0.35)
  Top 0.152: IC3.6 23.3,43.8 21.8,42.3 21.2,42.3 20.3,41.4 20.3,39.9 v20.5,39.7 | T6.4 23.75,37.45 23.5,37.7 21.3,37.7 v20.9,38.1
  Bottom 0.152: v20.9,38.1 20.5,38.5 v20.5,39.7
N$4
  Top 0.152: IC1.20 28.52,10.31 C1.2
N$5
  Top 0.152: IC1.8 19.5,7.09 X2.3
N$6
  Top 0.152: R12.1 21.27,18.32 TP1.1
N$7
  Bottom 0.152: R3.2 14.62,25.46 IC4.23
N$8
  Bottom 0.152: U$11.#3 16.9,23.8 | 16.9,23.8 16.5,23.4 15.3,23.4 14.72,23.98 14.72,24.2 | 14.72,24.2 R1.2 | C8.1 16.9,23.05 16.9,23.8 | IC4.25 13.76,24.2 14.72,24.2
N$9
  Top 0.152: U$17.1 6.57,37.17 R15.2
N$10
  Top 0.152: R27.2 10.7,35.88 U$16.1
N$12
  Top 0.152: R7.2 19.5,43.1 U$7.4
N$15
  Top 0.152: IC1.7 19.71,8.59 18.8,9.5 18.8,9.4 18.1,9.4 X2.1
N$16  (via drill 0.35)
  Top 0.152: IC1.9 20.29,5.29 19.09,5.29 v18.9,5.1 | v12.7,17.6 12.4,17.9 12.4,21.6 12,22 8.4,22 7.3,20.9 v7.2,20.9
  Bottom 0.152: v18.9,5.1 16.9,5.1 15.1,6.9 15.1,15.1 13.5,16.7 13.2,16.7 12.9,17 12.9,17.4 v12.7,17.6 | S1.2 5.35,21.65 6.1,20.9 v7.2,20.9
N$17
  Top 0.152: R13.1 20.58,16.52 18.13,18.98 TP2.1
N$18
  Top 0.152: R11.2 27.23,46.97 25.85,48.35 25.85,48.4 | 25.85,48.4 T3.1 | T10.3 25.3,48.4 25.85,48.4
N$19
  Top 0.152: RC.CATHODE 63.96,6.17 R5.2
N$20
  Top 0.152: JETSON.CATHODE 56.96,6.24 R10.2
N$23  (via drill 0.35)
  Top 0.152: U$8.3 22.27,27.43 18.6,31.1 11.2,31.1 9.4,32.9 1.8,32.9 v1.4,32.5
  Bottom 0.152: v1.4,32.5 1.4,28.7 2.05,28.05 R6.1
N$24  (via drill 0.35)
  Top 0.152: U$15.3 26.05,25.35 24.6,26.8 23.6,26.8 23,27.4 23,28.5 v22.3,29.2
  Bottom 0.152: R4.1 3.2,31.7 3.7,32.2 11.1,32.2 12.2,31.1 14.6,31.1 14.9,30.8 19.6,30.8 21.2,29.2 v22.3,29.2
N$25  (via drill 0.35)
  Top 0.152: U3.1 13.46,33.6 13.46,32.94 13.8,32.6 v15.4,32.6 | v17.6,38.5 17.4,38.7 17,38.7 16.73,38.42 R25.2
  Bottom 0.152: v15.4,32.6 17.6,34.8 v17.6,38.5
N$26
  Top 0.152: T1.3 14.1,36.1 12.4,36.1 12.19,35.89 U3.2
N$27
  Top 0.152: T1.1 15.35,39.1 R32.1 R28.1
N$28
  Top 0.152: R33.1 2.4,37.7 RC_POWER.CATHODE
N$29
  Top 0.152: T2.1 15.5,24.75 15.5,25.3 15.25,25.55 R36.2 14.5,26.25 R35.1
N$30
  Top 0.152: T2.3 16.6,27.3 16.91,27.61 U7.2
N$31
  Bottom 0.152: IC5.4 9.47,49.27 C14.2
N$33
  Top 0.152: U7.1 15.64,29.24 16,29.6 17.7,29.6 18,29.3 R30.1
N$34
  Top 0.152: T11.1 43.2,46.45 R47.2 43.2,44.6 42.4,43.8 39.1,43.8 R48.1
N$35
  Top 0.152: R18.2 22.15,48.6 T10.1 22.7,49.15 R19.1
N$36
  Top 0.152: T11.3 41.6,48.2 R20.2 40.7,45.9 39.1,45.9 38.5,46.5 38.5,48 37.9,48.6 36.5,48.6 35.85,47.95 T4.1
N$38  (via drill 0.35)
  Top 0.152: v32.3,49.5 32.2,49.6 31.7,49.6 31.6,49.7 29.8,49.7 29.2,49.1 29.2,48.5 30.4,47.3 30.4,45 28.3,42.9 28.3,29.6 26.5,27.8 v24,27.8
  Bottom 0.152: IC4.19 13.76,28.1 14.9,28.1 15.9,29.1 18.9,29.1 20.2,27.8 v24,27.8 | v32.3,49.5 32.7,49.1 32.7,47.6 33,47.3 R37.2
N$40
  Top 0.152: T5.1 8.75,27.4 9.1,27.4 9.6,27.9 R49.1 9.6,28.4 9.4,28.6 U$16.5
N$41  (via drill 0.35)
  Bottom 0.152: R38.2 26.4,45.9 26.4,35.3 v26.6,35.1 27.3,34.4 27.3,32.1 23.6,28.4 20.6,28.4 19.1,29.9 15.8,29.9 14.6,28.7 13.72,28.7 IC4.18
N$42
  Top 0.152: U$17.5 5.3,28.45 R50.1 5.55,26.7 T5.3
N$43
  Bottom 0.152: 37.45,47.3 M1.1
  Bottom 0.305: R41.2 R37.1 37.45,47.3
N$44
  Bottom 0.152: M4.1 29.75,47.55
  Bottom 0.305: R42.2 R38.1 29.75,47.55
N$45
  Bottom 0.152: 42.2,52.87 FRONT_LED.1:GND
  Bottom 0.305: R39.2 42.2,52.87
N$46
  Bottom 0.305: M1.3 39.9,48.8 R39.1
N$47
  Bottom 0.305: M4.3 35.3,48.5 35.8,49 R40.1
N$48
  Bottom 0.305: REAR_LED.1:GND 33.47,50.73 R40.2
N$49
  Bottom 0.152: R43.1 18.15,25.75 U$11.#1 18.4,25.5 18.9,25.5 19.35,25.05 R44.2
N$54
  Top 0.152: R56.1 15.9,49.7 | 15.9,49.7 16.7,49.7 U$10.3 | 15.9,49.7 15.9,49.2 D4.A 15.2,48.5 14.6,48.5 14.1,49 R70.2
N$55
  Top 0.152: R64.2 14.75,46.75 D4.K 15.3,45.7 15.9,45.1 U$7.2
N$57
  Top 0.152: R58.1 9.1,49.25 U12.3 | R58.1 7.95,48.75 7.7,49 D6.A | R58.1 8.15,49.2 R71.2
N$58
  Top 0.152: U20.2 9.1,43.5 7.3,45.3 D6.K 7.05,46.85 R65.2
N$59
  Top 0.152: R8.2 12.15,41.7 U20.4
N$60
  Top 0.152: D7.A 2.15,48.45 R72.2 | R72.2 3.1,49 U21.3 | R72.2 1.3,49.85 R60.1
N$62
  Top 0.152: D7.K 1.5,45.4 1.5,43.7 U23.2 3.2,43.7 4.05,42.85 R66.2
N$63
  Top 0.152: R9.2 5.85,43.85 5.3,43.3 U23.4
N$64
  Top 0.152: R69.2 R61.2 17.6,50.35 U$10.2
N$68
  Top 0.152: U21.2 4,49.95 R63.2 R67.2
N$69
  Bottom 0.152: C13.2 20.8,53.1 IC7.4
N$70
  Bottom 0.152: IC7.3 24.35,54.15 24.7,54.5 24.7,55.6 24.25,56.05 IC7.1 22.8,56.65 C16.2 22.8,58.38 D1.1
N$72
  Top 0.152: U$10.5 U$10.6 19.1,47.35 R55.1
N$73
  Top 0.152: U12.2 10.6,49.8 10.9,50.1 10.9,50.6 | R62.2 10.9,50.6 | 10.9,50.6 R68.2
N$74
  Top 0.152: R57.1 11.25,46.2 | 11.25,46.2 U12.6 | U12.5 10.6,46.4 10.8,46.2 11.25,46.2
N$75
  Top 0.152: R59.1 4,46.65 U21.5 4,47.6 4.1,47.7 4.5,47.7 4.65,47.55 U21.6
PCH1  (via drill 0.35)
  Top 0.152: IC3.2 25.9,43.8 v25.5,43.4 | R7.1 17.19,41.81 v16.8,42.2 16.6,42.4 14.3,42.4 13.7,41.8 13.2,41.8 12.8,41.4 12.8,40.4 12.2,39.8 11.5,39.8 10.7,39 R27.1 10.5,39.1 TP5.1
  Bottom 0.152: v16.8,42.2 16.9,42.3 21.8,42.3 22.9,43.4 v25.5,43.4
PCH2  (via drill 0.35)
  Top 0.152: v14.39,41.4 14.3,41.3 13.9,41.3 13.4,40.8 13.4,40.2 11.3,38.1 9.8,38.1 9.3,37.6 8.3,37.6 7.1,38.8 R15.1 6.2,39.2 TP6.1 10.65,40.7 R8.1 | v21.41,41.4 21.8,41.4 23.95,43.54 IC3.5
  Bottom 0.152: v14.39,41.4 v21.41,41.4
PCH3  (via drill 0.35)
  Top 0.152: IC1.26 26.29,19.01 23.7,21.6 14.3,21.6 11.5,24.4 v11.3,24.4 11.1,24.6 R24.1 | U3.3 12.19,27.49 v11.8,27.1
  Bottom 0.152: v11.3,24.4 11.3,26.6 v11.8,27.1
PCH6  (via drill 0.35)
  Top 0.152: R29.2 16.91,34.78 U7.3 16.91,35.39 16.4,35.9 16.1,35.9 v15.7,36.3 | v24.8,42.5 26,42.5 26.55,43.05 IC3.1
  Bottom 0.152: v15.7,36.3 16,36.6 16,39.2 17.4,40.6 21.9,40.6 23.8,42.5 v24.8,42.5
PCH_1  (via drill 0.35)
  Top 0.152: R35.2 12.64,26.19 v12.64,25.84 | v14.6,17.5 14.6,16.2 17.1,13.7 19.1,13.7 19.4,14 20.9,14 21.7,13.2 22.2,13.2 22.7,12.7 22.7,10.8 v22.6,10.7 | v23.5,8.3 23.8,8.3 24.69,7.41 IC1.13
  Bottom 0.152: v12.64,25.84 12.4,25.6 12.4,20.1 14.6,17.9 v14.6,17.5 | v22.6,10.7 23.5,9.8 v23.5,8.3
PH1-328  (via drill 0.35)
  Top 0.152: v16.4,17.8 18.57,17.8 21.49,14.88 IC1.32 | T5.6 8.75,22.8 9.7,22.8 10.4,23.5 11.36,23.5 v11.51,23.36
  Bottom 0.152: v16.4,17.8 15.14,16.54 14.57,16.54 13.6,17.51 13.6,17.9 11.9,19.6 11.9,21.3 11.61,21.59 11.61,23.36 v11.51,23.36
PH2_328  (via drill 0.35)
  Top 0.152: IC1.1 20.09,13.29 16.82,13.29 14.4,15.7 v13.4,15.7 | T5.4 5.85,20.75 7.9,18.7 11.29,18.7 v11.59,18.4
  Bottom 0.152: v13.4,15.7 11.6,17.5 v11.6,18.39 v11.59,18.4
RC_+B_3V3  (via drill 0.35)
  Top 0.152: U$7.5 19.25,45.8 18.7,45.8 v18.3,45.4 18.3,43.9 17.6,43.2 15.1,43.2 TP4.1 13.85,43.6 U20.5 13,44.05 12,43.05 12,42.4 11.4,41.8 9.6,41.8 7.9,43.5 7.9,43.9 7.15,44.65 U23.5 | v16.1,40.7 16.9,40.7 19.25,38.35 19.25,37.05 C22.2 20.5,35.7 | C19.2 14.55,33.6 15.3,33.6 15.64,33.94 | U7.4 15.64,33.94 | 15.64,33.94 15.64,33.26 17.3,31.6 19.68,31.6 19.7,31.62 | IC3.16 26.55,36.75 C10.2 26.5,36.2 25.9,35.6 23.3,35.6 22.8,36.1 | R52.2 23.83,32.88 U$15.6 23.83,31.13 v23.2,30.5 20.1,30.5 19.7,30.9 19.7,31.62 | 20.5,35.7 20.5,34.4 v20.4,34.3 19.75,33.65 R51.2 19.75,31.67 U$8.6 19.7,31.62 | 20.5,35.7 21.1,35.7 21.4,35.4 22.1,35.4 22.8,36.1 | T6.5 22.8,36.1
  Bottom 0.152: IC7.5 19.25,56.05 C11.2 18.5,55.9 17.5,54.9 17.5,49.3 16.8,48.6 16.8,46.9 v18.3,45.4 15.7,42.8 14.3,42.8 13.3,41.8 13.3,40.5 14.1,39.7 15.1,39.7 v16.1,40.7 | v20.4,34.3 20.1,34 C9.2 | v23.2,30.5 23.7,30.5 24.4,31.2 C20.2
RC_VCC  (via drill 0.35)
  Top 0.152: U$1.16:TH_VCC 40.68,55.42 39.8,56.3 31.1,56.3 30.52,55.72 | U$1.12:ST_VCC 30.52,55.72 | 30.52,55.72 29.84,56.4 21.2,56.4 20.36,55.56 20.36,55.5 | 20.36,55.5 U$1.8:VCC1 20.36,49.71 R55.2 | 20.36,55.5 18.36,57.5 15,57.5 | 15,57.5 13.1,57.5 | 13.1,57.5 12.74,57.14 U$1.5:VCC2 12.74,52.36 | U$1.2:VCC3 v5.12,55.9 5.12,56.22 5.3,56.4 | 13.1,57.5 6.4,57.5 5.3,56.4 | R60.2 1.3,55.2 2.6,56.5 5.2,56.5 5.3,56.4 | v16.5,56.7 15.8,56.7 15,57.5 | R58.2 8.6,46.3 9.7,45.2 11.6,45.2 12.35,45.95 R57.2 12.35,46.6 11.9,47.05 11.9,47.8 12.2,48.1 12.2,49.5 12.74,50.04 12.74,52.36 | RC_POWER.ANODE 1.3,41 v1.4,41.1 | v5.8,45.7 4.75,45.7 R59.2 | R56.2 14.75,50.35 12.74,52.36
  Bottom 0.152: D1.2 18.88,57.9 17.1,57.9 16.5,57.3 v16.5,56.7 16.9,56.3 16.9,49.7 15.37,48.17 D2.A | v1.4,41.1 3.4,41.1 5.8,43.5 v5.8,45.7 5.8,55.22 v5.12,55.9
  pour Top (no thermals): 0.8,55.3 0.8,51.6 1,51.4 1.6,51.4 1.6,54.7 2.5,55.6 3.7,55.6 4.6,54.7 4.6,51.5 4.8,51.3 5.6,51.3 5.7,51.4 5.7,55.1 6.7,56.1 11.7,56.1 12.2,55.6 12.2,51.5 12.3,51.4 13.1,51.4 13.3,51.6 13.3,51.7 13.3,55.7 13.7,56.1 16.5,56.1 17.1,55.5 17.2,55.4 19.4,55.4 19.8,55 19.8,51.6 20,51.4 20.8,51.4 20.9,51.5 20.9,51.6 20.9,54.9 21.8,55.8 22,55.8 28.8,55.8 30,54.6 30,51.6 30.1,51.5 31.1,51.5 31.1,54.6 32.1,55.6 39.4,55.6 40.1,54.9 40.1,51.5 40.2,51.4 41,51.4 41.3,51.7 41.3,51.8 41.3,55.8 39.9,57.2 20.1,57.2 19,58.3 3.8,58.3
RC_VCC2  (via drill 0.35)
  Top 0.152: R20.1 39.6,47.2 R21.1 40.2,48.5 40.5,48.8 40.5,49.1 40.9,49.5 42,49.5 v43.2,48.3 | R11.1 29.3,45.97 29.3,47.4 28.6,48.1 28.6,50.1 v29.1,50.6
  Bottom 0.152: C21.2 12.88,52.27 IC5.1 | 29.05,58.25 29.1,58.2 v29.1,50.6 29.1,49.8 R14.1 | 29.05,58.25 26.1,61.2 17.7,61.2 15.3,58.8 15.3,52.7 14.17,51.57 C21.2 | 29.05,58.25 40.25,58.25 44.3,54.2 44.3,49.4 v43.2,48.3 | C21.2 13.57,50.88 13.55,50.85 | 12.4,50.37 13.07,50.37 13.55,50.85 | 12.4,50.37 IC5.3 | D2.C 13.93,50.47 13.55,50.85 | BYPASS.2 12.5,48 12.5,50.27 12.4,50.37
RCH1
  Top 0.152: R18.1 21.4,47.6 23.1,47.6 23.6,47.1 23.6,46.8 23.8,46.6 24.4,46.6 24.6,46.4 IC3.4
RCH2  (via drill 0.35)
  Top 0.152: v28.13,44.8 28.13,45.2 26.43,46.9 v25.8,46.9 | R47.1 41.2,44.9 v39.7,44.9 | v20.8,44.3 20.8,44 21.3,43.5 22.2,43.5 22.65,43.95 IC3.7
  Bottom 0.152: v28.13,44.8 29.03,43.9 38.7,43.9 v39.7,44.9 | v20.8,44.3 20.75,44.35 23.3,46.9 v25.8,46.9
RX  (via drill 0.35)
  Top 0.152: IC2.10 42.89,15.97 42.89,17.81 v42.6,18.1
  Bottom 0.152: v42.6,18.1 39.5,18.1 38.41,19.2 37.8,19.2 37.6,19 R46.2
SCL  (via drill 0.35)
  Top 0.152: v23.8,12.8 24.69,13.69 IC1.28 | IC2.5 37,14.24 37,20.7 v36.9,20.8
  Bottom 0.152: IC2.5 38.21,12.72 38.7,12.23 38.7,9.9 38.49,9.69 R22.1 38.53,8.87 38.53,7.43 37.8,6.7 25.1,6.7 24.3,7.5 24.3,9.8 23.4,10.7 23.4,11.1 23.8,11.5 v23.8,12.8 | IC4.26 13.72,23.5 14.3,23.5 15.6,22.2 23.9,22.2 25,23.3 33.4,23.3 35.9,20.8 v36.9,20.8 46.2,20.8 47.2,19.8 74.8,19.8 77.6,17 77.6,11.7 76.8,10.9 I2C.SCL
SDA  (via drill 0.35)
  Top 0.152: v25.5,13.1 v25.49,13.11 IC1.27 | v33.4,21.9 34.4,20.9 34.4,14.2 35.56,13.04 35.6,13.04 | 35.6,13.04 IC2.3 | 35.6,13.04 35.6,13 37,11.6 38.9,11.6 39.5,12.2 39.5,13.8 40,14.3 44.2,14.3 44.6,14.7 44.6,16.4 43.7,17.3 43.7,18.6 44.1,19 50.5,19 51.3,18.2 v73.8,18.2
  Bottom 0.152: v25.5,13.1 25.8,12.8 25.8,11.5 28.05,9.25 31.89,9.25 31.92,9.28 | v33.4,21.9 32.6,22.7 25.4,22.7 24.4,21.7 15.3,21.7 14.14,22.86 IC4.27 | v73.8,18.2 75,17 75,11.7 74.8,11.5 I2C.SDA | IC2.3 31.92,9.28 | 31.92,9.28 32.2,9 34.3,9 34.6,9.3 35.98,9.3 R23.1
SIGNAL1_INPUT
  Top 0.152: R61.1 16.15,50.95 16.7,51.5 16.7,52.1 17.6,53 U$1.7:SIGNAL1
SIGNAL2_INPUT
  Top 0.152: R62.1 8.95,51.75 U$1.4:SIGNAL2
SIGNAL3_INPUT
  Top 0.152: R63.1 2.45,52.87 U$1.1:SIGNAL3
ST_OUTPUT  (via drill 0.35)
  Top 0.152: v25.6,50.5 26,50.9 T3.3 | 27.98,52.2 U$1.11:ST_SIGNAL
  Top 0.406: T3.3 27.98,52.08 27.98,52.2
  Bottom 0.152: R14.2 26,49.2 25.6,49.6 v25.6,50.5
TH_OUTPUT
  Top 0.152: U$1.15:TH_SINGNAL 38.14,51.24 | 38.14,51.24 38.14,50.74 38.78,50.1 R21.2 | 38.14,51.24 T4.3
TX  (via drill 0.35)
  Top 0.152: v38,18.4 40.75,15.65 IC2.8
  Bottom 0.152: v38,18.4 37.6,18 R45.2
VCC_RC1_5V  (via drill 0.35)
  Top 0.152: v18.5,37.4 17.82,36.72 R25.1
  Bottom 0.152: IC5.5 9.47,53.38 C15.2 | IC5.5 8.3,51.09 8.3,47.4 | 8.3,47.4 8.3,44.3 9.2,43.4 10.8,43.4 11.7,42.5 11.7,40.1 14.8,37 14.8,36 15.5,35.3 16.3,35.3 16.7,35.7 16.7,39 17.4,39.7 18,39.7 18.6,39.1 18.6,37.5 v18.5,37.4 | BYPASS.1 9.7,47.2 8.5,47.2 8.3,47.4 | IC5.5 7.93,52.27 TP10.1

## Text on the board
tPlace: 3 | 2 | 1 | ST | TH | VCC | VCC | VCC | VCC | VCC | SIGNAL | SIGNAL | SIGNAL | SIGNAL | SIGNAL | RC_POWER | D | #612 | J | Designed in Aizu | Rev 2.0.22 | 1 | ICSP | 39 | RC | Jetson
bPlace: LED11 | LED12 | S/N | + | + | 33 | 5 | F-612-2-22-A-N-J-1-P | Rev 2.0.22 | Designed in Aizu
Document: LP2985-33 | LP2985-50 | 2N7002K | 2N7002K | 2N7002K | 2N7002K | MC74HC157A | 2SC2712 | SN74LVC2G04 | 2SC2712 | SN74LVC2G04 | AVR 328P | #612 JetRacer Rev 2.0.22 / 2022/10/22 / 2022/11/09 R49,R50,R51,R52 350orm -> 390orm